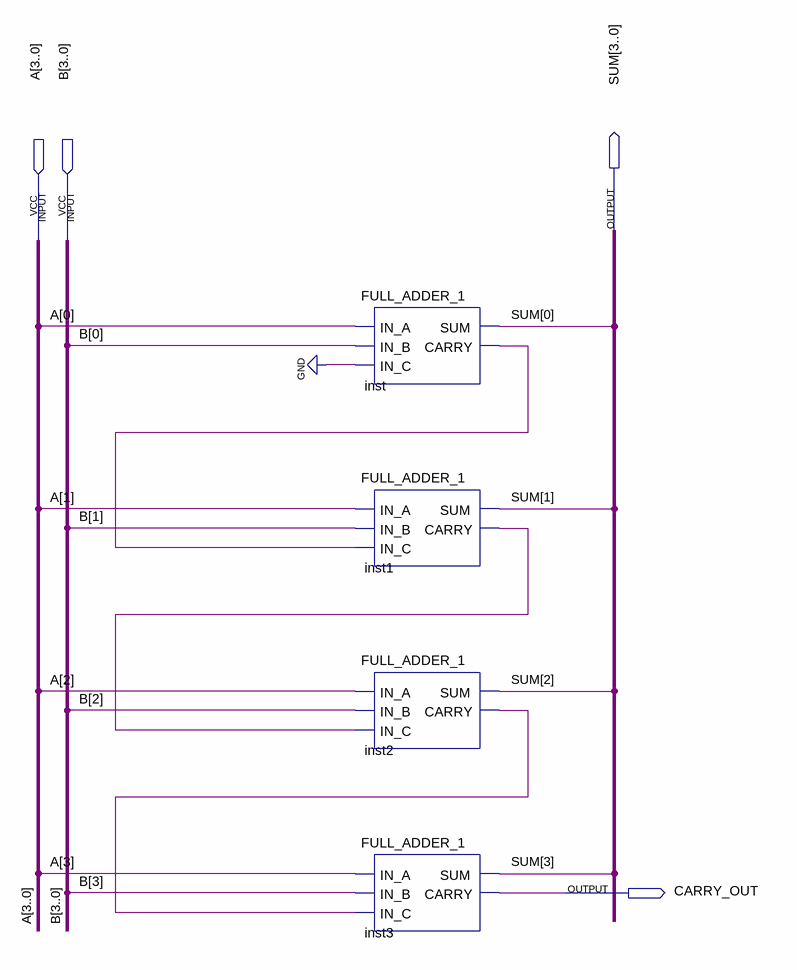
[diagram p0: schematic sheet]
// Quartus schematic ADDITION_BUS.bdf as structural Verilog: 4 symbols, 4 pins
module ADDITION_BUS (
  input  [3:0] A,
  input  [3:0] B,
  output [3:0] SUM,
  output CARRY_OUT
);

  wire inst1_carry, inst2_carry, inst_carry;

  FULL_ADDER_1 inst (.IN_A(A[0]), .IN_B(B[0]), .IN_C(1'b0), .SUM(SUM[0]), .CARRY(inst_carry));
  FULL_ADDER_1 inst1 (.IN_A(A[1]), .IN_B(B[1]), .IN_C(inst_carry), .SUM(SUM[1]), .CARRY(inst1_carry));
  FULL_ADDER_1 inst2 (.IN_A(A[2]), .IN_B(B[2]), .IN_C(inst1_carry), .SUM(SUM[2]), .CARRY(inst2_carry));
  FULL_ADDER_1 inst3 (.IN_A(A[3]), .IN_B(B[3]), .IN_C(inst2_carry), .SUM(SUM[3]), .CARRY(CARRY_OUT));
endmodule
